# EAGLE schematic FAST_DEPLOY_E_FUSE (EAGLE 9.6.2)

## Sheet 1 of 5: LTC4222 Sheet
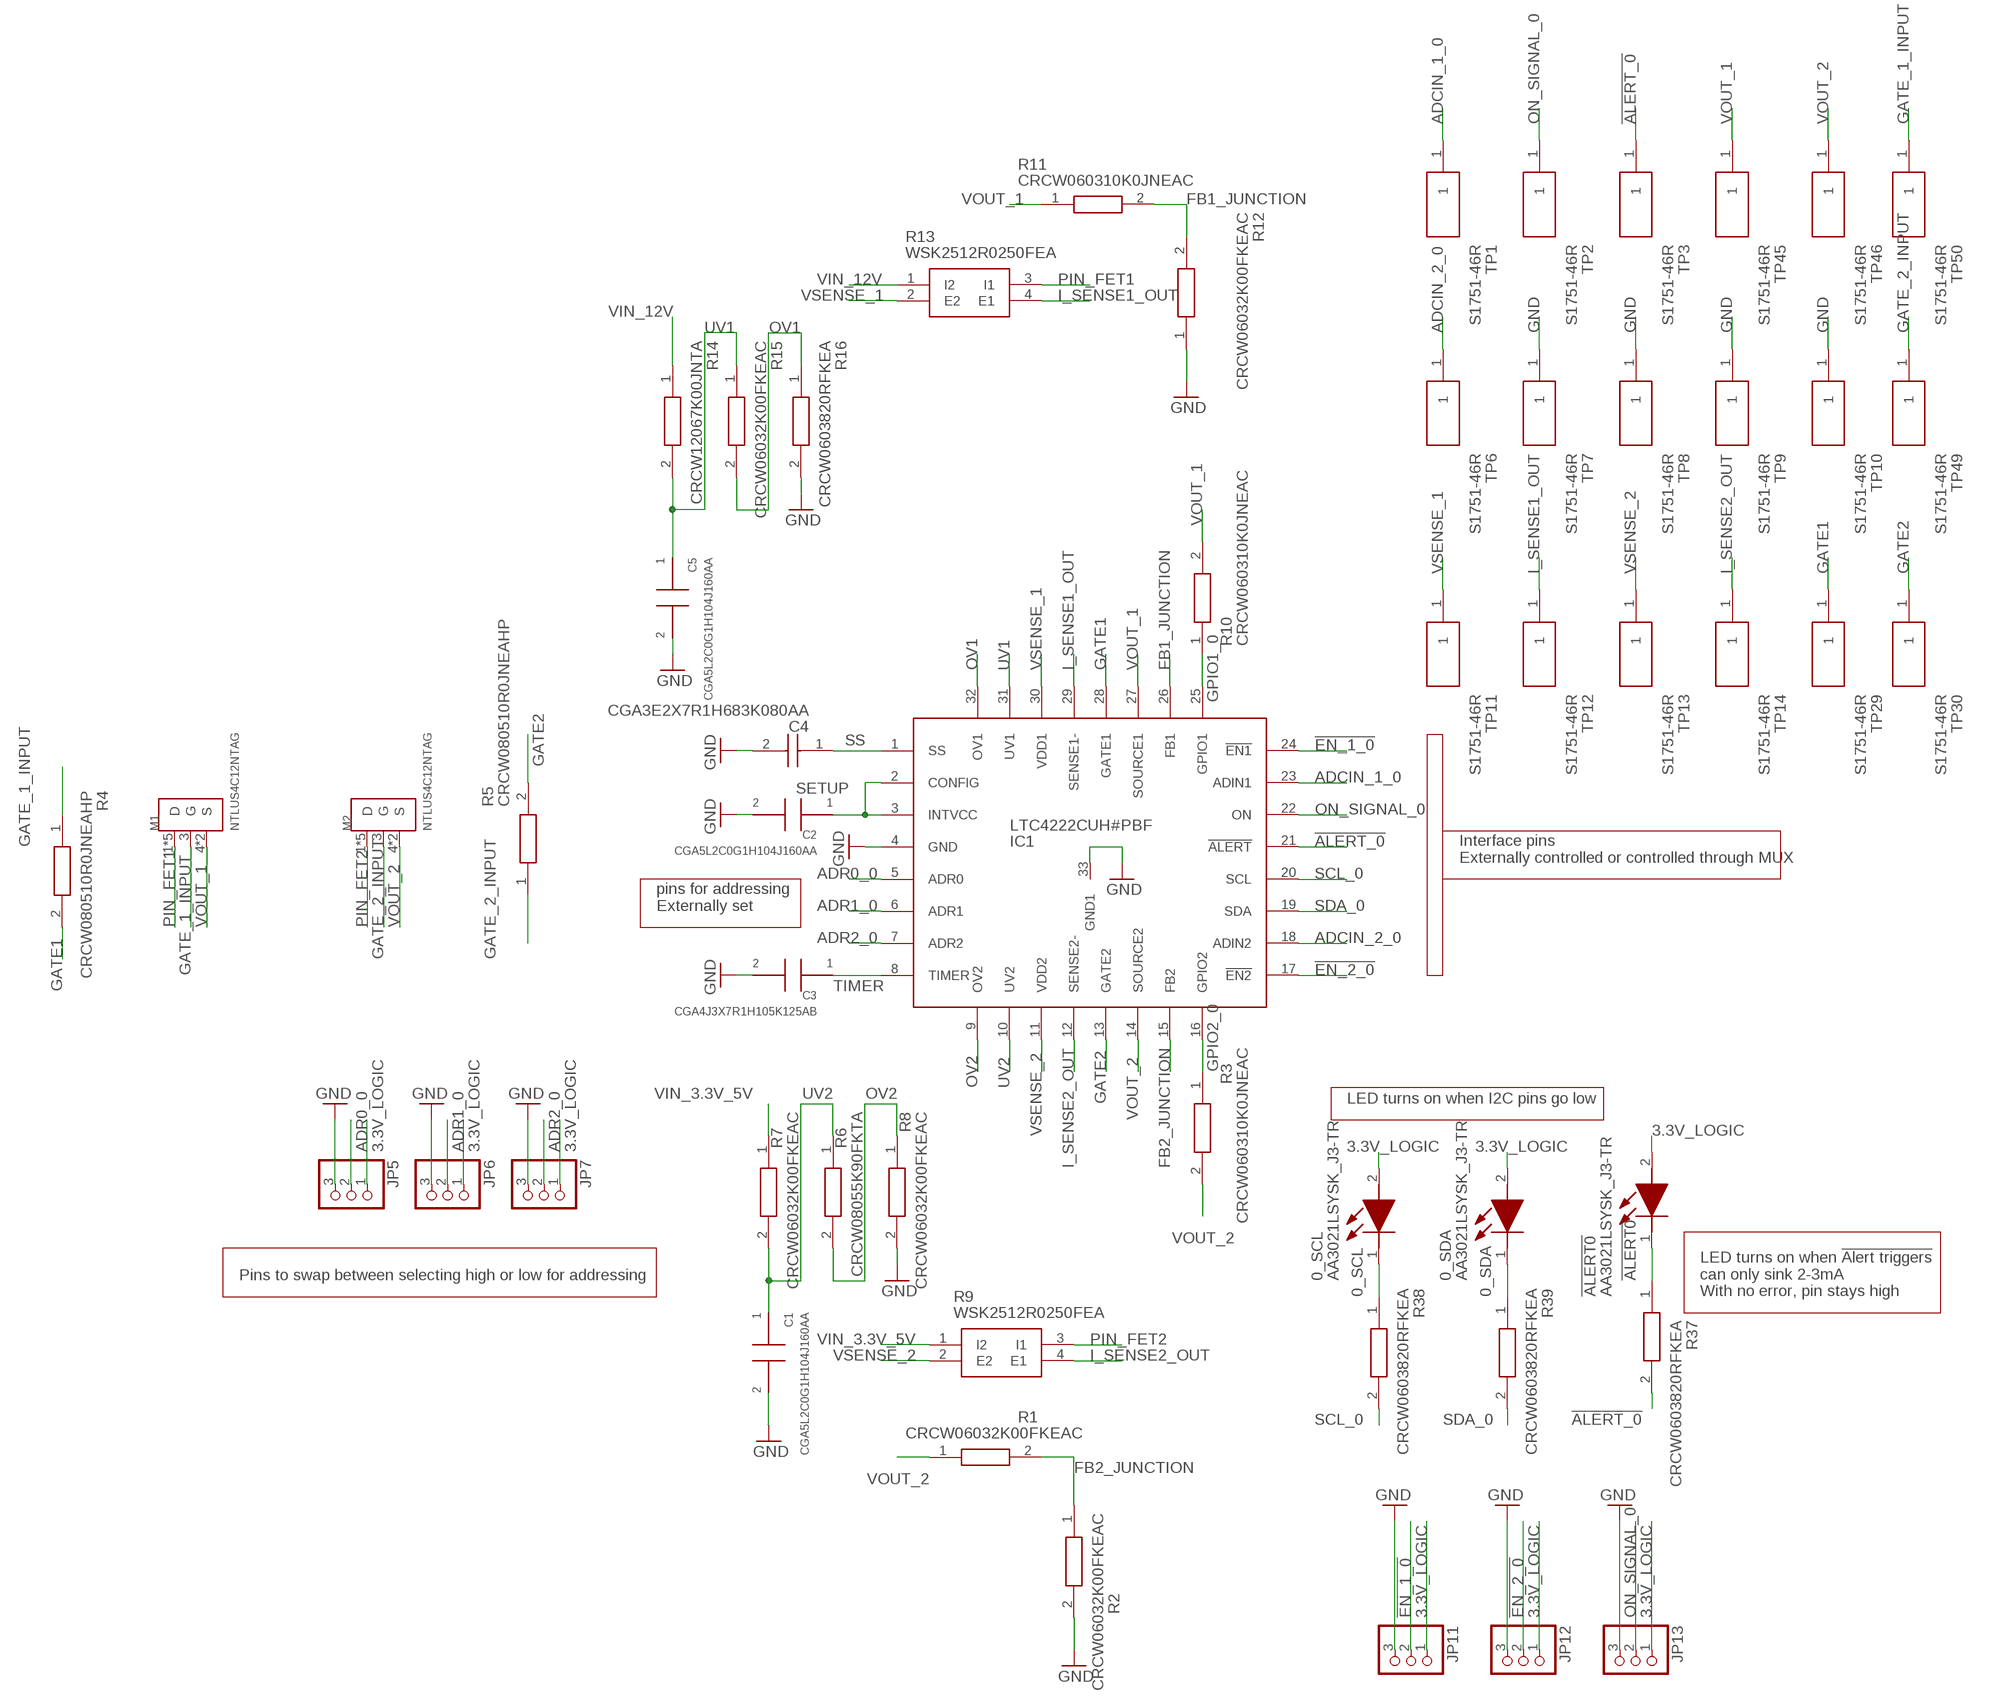
[diagram p0: schematic, sheet 1, part 1 of 2]
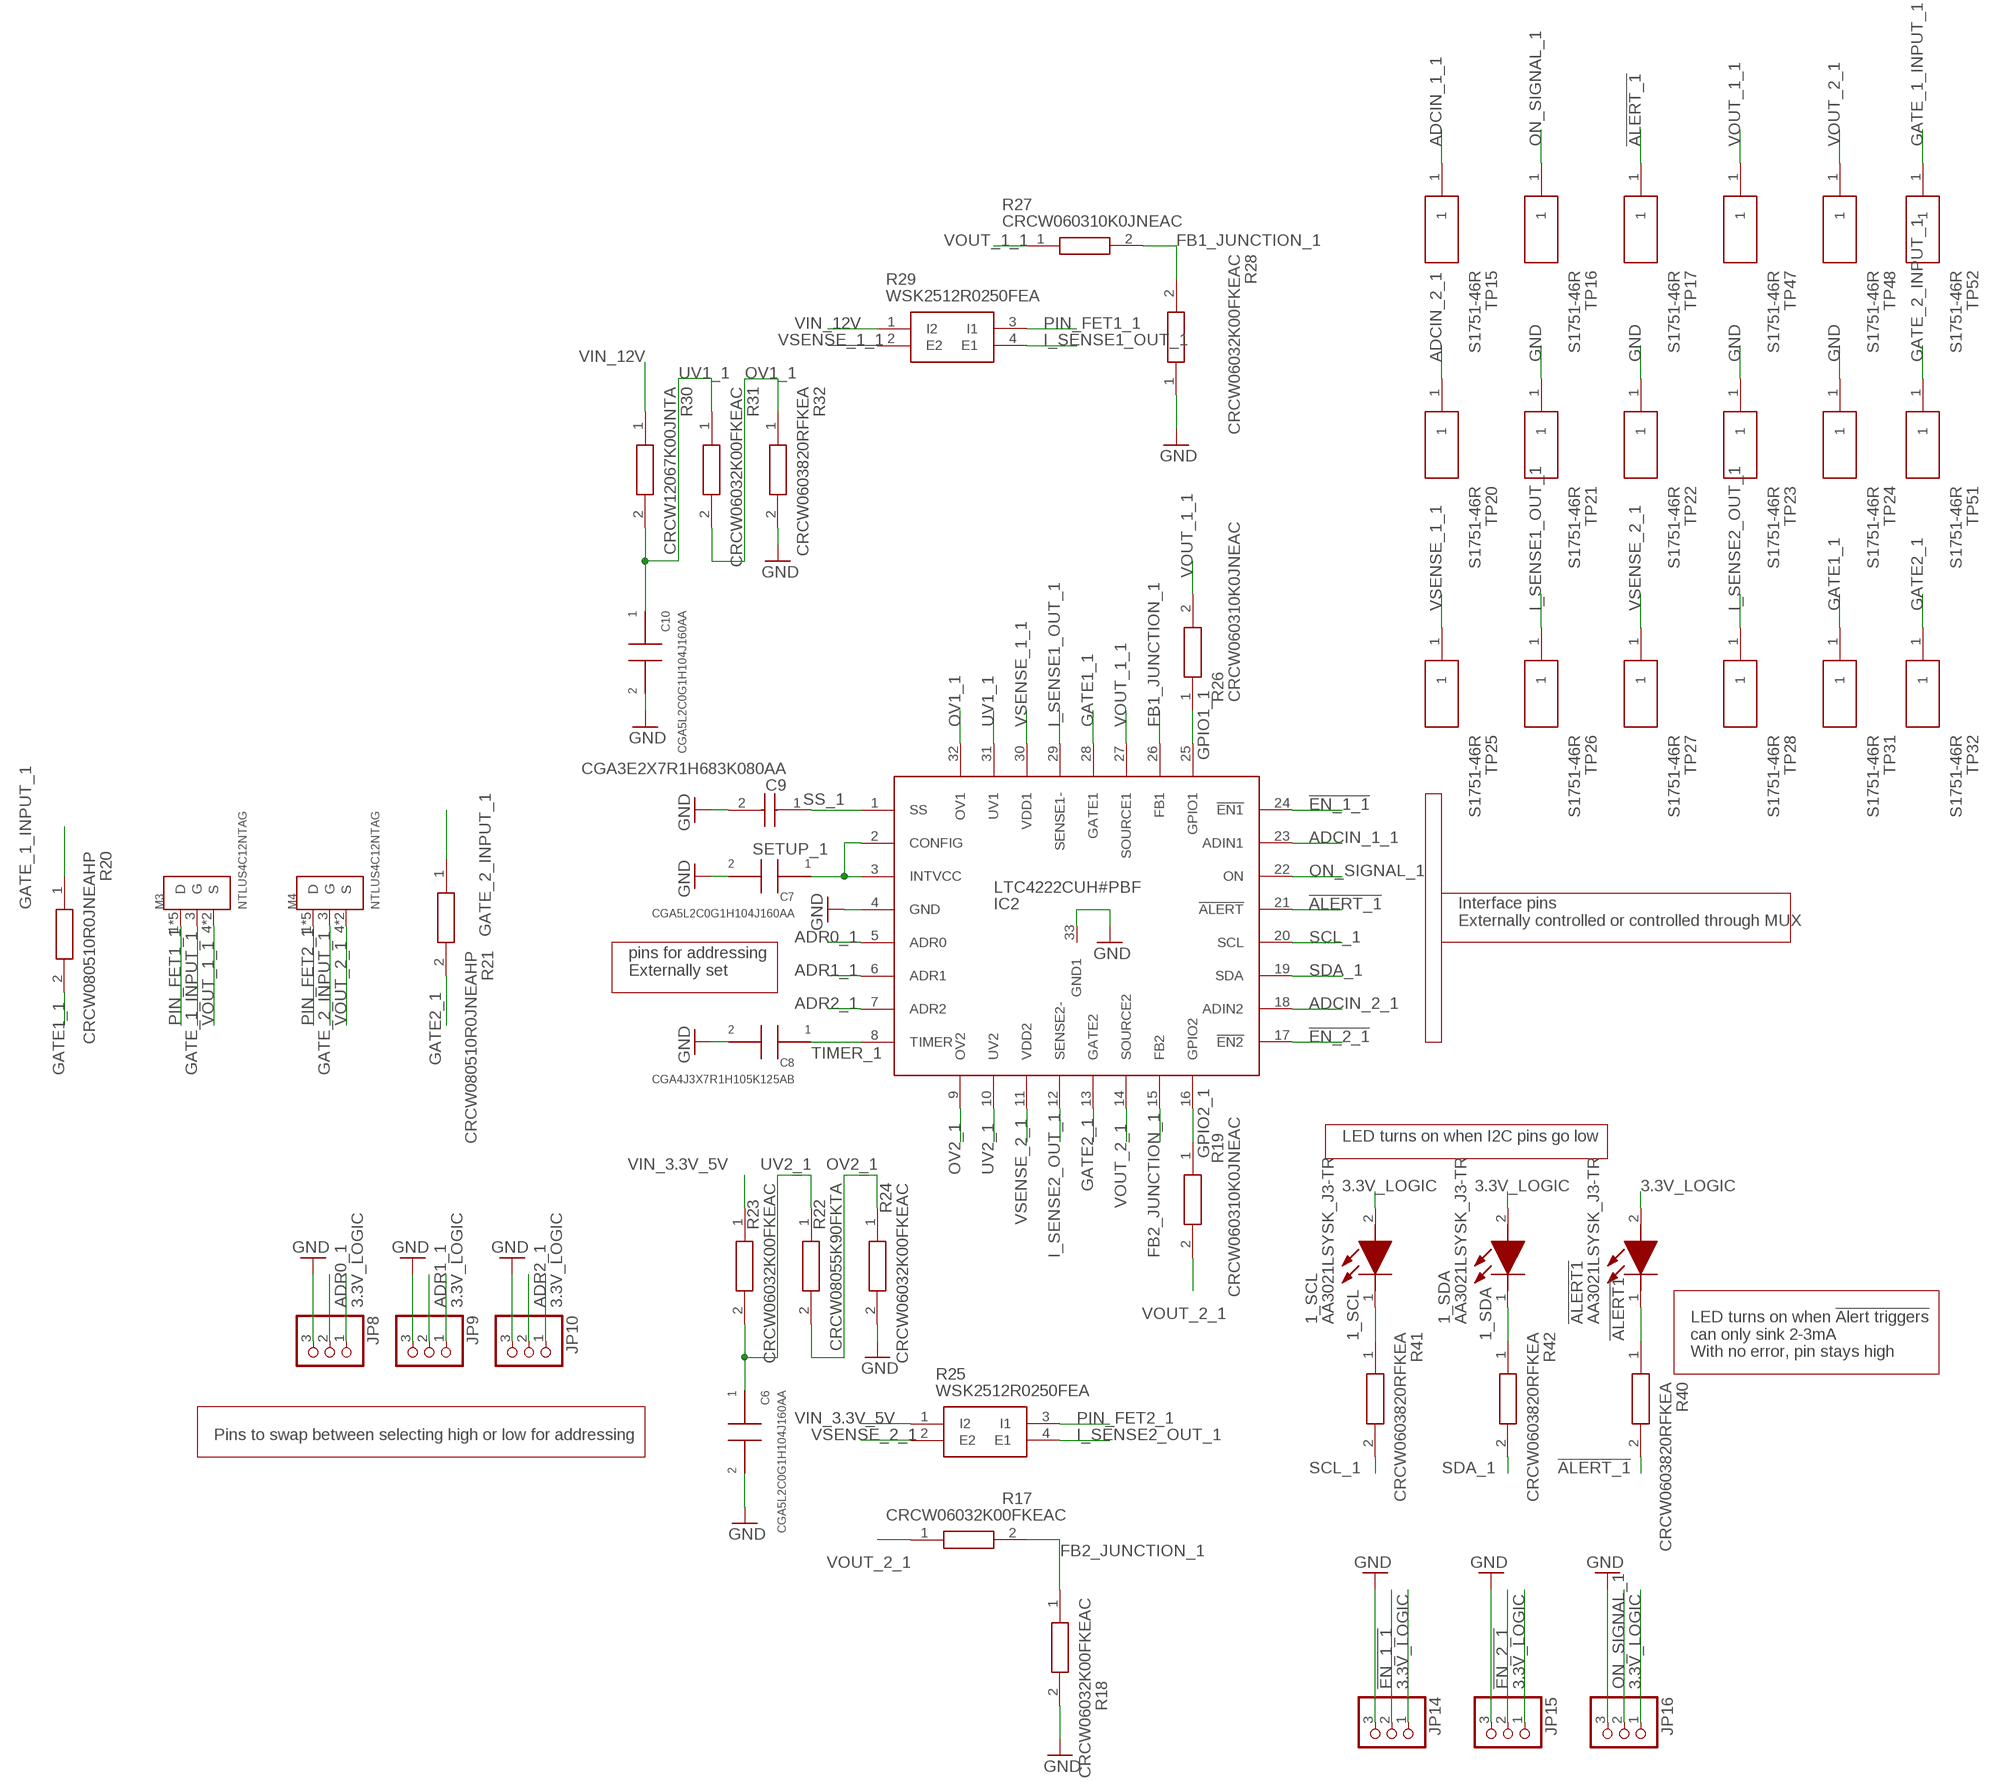
[diagram p1: schematic, sheet 1, part 2 of 2]

### Parts
0_SCL  AA3021LSYSK_J3-TR  [AA3021LSYSKJ3TR]
0_SDA  AA3021LSYSK_J3-TR  [AA3021LSYSKJ3TR]
1_SCL  AA3021LSYSK_J3-TR  [AA3021LSYSKJ3TR]
1_SDA  AA3021LSYSK_J3-TR  [AA3021LSYSKJ3TR]
!ALERT0  AA3021LSYSK_J3-TR  [AA3021LSYSKJ3TR]
!ALERT1  AA3021LSYSK_J3-TR  [AA3021LSYSKJ3TR]
C1  CGA5L2C0G1H104J160AA  [CAPC3216X180N]
C2  CGA5L2C0G1H104J160AA  [CAPC3216X180N]
C3  CGA4J3X7R1H105K125AB  [CAPC2012X145N]
C4  CGA3E2X7R1H683K080AA  [CAPC1608X90N]
C5  CGA5L2C0G1H104J160AA  [CAPC3216X180N]
C6  CGA5L2C0G1H104J160AA  [CAPC3216X180N]
C7  CGA5L2C0G1H104J160AA  [CAPC3216X180N]
C8  CGA4J3X7R1H105K125AB  [CAPC2012X145N]
C9  CGA3E2X7R1H683K080AA  [CAPC1608X90N]
C10  CGA5L2C0G1H104J160AA  [CAPC3216X180N]
IC1  LTC4222CUH#PBF  [QFN50P500X500X80-33T345N]
IC2  LTC4222CUH#PBF  [QFN50P500X500X80-33T345N]
JP5  PINHD-1X3  [1X03]
JP6  PINHD-1X3  [1X03]
JP7  PINHD-1X3  [1X03]
JP8  PINHD-1X3  [1X03]
JP9  PINHD-1X3  [1X03]
JP10  PINHD-1X3  [1X03]
JP11  PINHD-1X3  [1X03]
JP12  PINHD-1X3  [1X03]
JP13  PINHD-1X3  [1X03]
JP14  PINHD-1X3  [1X03]
JP15  PINHD-1X3  [1X03]
JP16  PINHD-1X3  [1X03]
M1  NTLUS4C12NTAG  [TRANS_NTLUS3A18PZTAG]
M2  NTLUS4C12NTAG  [TRANS_NTLUS3A18PZTAG]
M3  NTLUS4C12NTAG  [TRANS_NTLUS3A18PZTAG]
M4  NTLUS4C12NTAG  [TRANS_NTLUS3A18PZTAG]
R1  CRCW06032K00FKEAC  [RESC1608X55N]
R2  CRCW06032K00FKEAC  [RESC1608X55N]
R3  CRCW060310K0JNEAC  [RESC1608X55N]
R4  CRCW080510R0JNEAHP  [RESC2012X60N]
R5  CRCW080510R0JNEAHP  [RESC2012X60N]
R6  CRCW08055K90FKTA  [RESC2012X50N]
R7  CRCW06032K00FKEAC  [RESC1608X55N]
R8  CRCW06032K00FKEAC  [RESC1608X55N]
R9  WSK2512R0250FEA  [WSK2512R0100FEA]
R10  CRCW060310K0JNEAC  [RESC1608X55N]
R11  CRCW060310K0JNEAC  [RESC1608X55N]
R12  CRCW06032K00FKEAC  [RESC1608X55N]
R13  WSK2512R0250FEA  [WSK2512R0100FEA]
R14  CRCW12067K00JNTA  [RESC3216X60N]
R15  CRCW06032K00FKEAC  [RESC1608X55N]
R16  CRCW0603820RFKEA  [RESC1608X50N]
R17  CRCW06032K00FKEAC  [RESC1608X55N]
R18  CRCW06032K00FKEAC  [RESC1608X55N]
R19  CRCW060310K0JNEAC  [RESC1608X55N]
R20  CRCW080510R0JNEAHP  [RESC2012X60N]
R21  CRCW080510R0JNEAHP  [RESC2012X60N]
R22  CRCW08055K90FKTA  [RESC2012X50N]
R23  CRCW06032K00FKEAC  [RESC1608X55N]
R24  CRCW06032K00FKEAC  [RESC1608X55N]
R25  WSK2512R0250FEA  [WSK2512R0100FEA]
R26  CRCW060310K0JNEAC  [RESC1608X55N]
R27  CRCW060310K0JNEAC  [RESC1608X55N]
R28  CRCW06032K00FKEAC  [RESC1608X55N]
R29  WSK2512R0250FEA  [WSK2512R0100FEA]
R30  CRCW12067K00JNTA  [RESC3216X60N]
R31  CRCW06032K00FKEAC  [RESC1608X55N]
R32  CRCW0603820RFKEA  [RESC1608X50N]
R37  CRCW0603820RFKEA  [RESC1608X50N]
R38  CRCW0603820RFKEA  [RESC1608X50N]
R39  CRCW0603820RFKEA  [RESC1608X50N]
R40  CRCW0603820RFKEA  [RESC1608X50N]
R41  CRCW0603820RFKEA  [RESC1608X50N]
R42  CRCW0603820RFKEA  [RESC1608X50N]
TP1  S1751-46R  [S175146R]
TP2  S1751-46R  [S175146R]
TP3  S1751-46R  [S175146R]
TP6  S1751-46R  [S175146R]
TP7  S1751-46R  [S175146R]
TP8  S1751-46R  [S175146R]
TP9  S1751-46R  [S175146R]
TP10  S1751-46R  [S175146R]
TP11  S1751-46R  [S175146R]
TP12  S1751-46R  [S175146R]
TP13  S1751-46R  [S175146R]
TP14  S1751-46R  [S175146R]
TP15  S1751-46R  [S175146R]
TP16  S1751-46R  [S175146R]
TP17  S1751-46R  [S175146R]
TP20  S1751-46R  [S175146R]
TP21  S1751-46R  [S175146R]
TP22  S1751-46R  [S175146R]
TP23  S1751-46R  [S175146R]
TP24  S1751-46R  [S175146R]
TP25  S1751-46R  [S175146R]
TP26  S1751-46R  [S175146R]
TP27  S1751-46R  [S175146R]
TP28  S1751-46R  [S175146R]
TP29  S1751-46R  [S175146R]
TP30  S1751-46R  [S175146R]
TP31  S1751-46R  [S175146R]
TP32  S1751-46R  [S175146R]
TP45  S1751-46R  [S175146R]
TP46  S1751-46R  [S175146R]
TP47  S1751-46R  [S175146R]
TP48  S1751-46R  [S175146R]
TP49  S1751-46R  [S175146R]
TP50  S1751-46R  [S175146R]
TP51  S1751-46R  [S175146R]
TP52  S1751-46R  [S175146R]

### Nets
0_SCL: 0_SCL.1(K) R38.1
0_SDA: 0_SDA.1(K) R39.1
1_SCL: 1_SCL.1(K) R41.1
1_SDA: 1_SDA.1(K) R42.1
3.3V_LOGIC: 0_SCL.2(A) 0_SDA.2(A) 1_SCL.2(A) 1_SDA.2(A) !ALERT0.2(A) !ALERT1.2(A) JP5.1 JP6.1 JP7.1 JP8.1 JP9.1 JP10.1 JP11.1 JP12.1 JP13.1 JP14.1 JP15.1 JP16.1 ; also sheet 2,3,4,5
!ALERT0: !ALERT0.1(K) R37.1
!ALERT1: !ALERT1.1(K) R40.1
!ALERT_0: IC1.21(!ALERT) R37.2 TP3.1 ; also sheet 5
!ALERT_1: IC2.21(!ALERT) R40.2 TP17.1 ; also sheet 5
!EN_1_0: IC1.24(!EN1) JP11.2
!EN_1_1: IC2.24(!EN1) JP14.2
!EN_2_0: IC1.17(!EN2) JP12.2
!EN_2_1: IC2.17(!EN2) JP15.2
ADCIN_1_0: IC1.23(ADIN1) TP1.1 ; also sheet 5
ADCIN_1_1: IC2.23(ADIN1) TP15.1 ; also sheet 5
ADCIN_2_0: IC1.18(ADIN2) TP6.1 ; also sheet 5
ADCIN_2_1: IC2.18(ADIN2) TP20.1 ; also sheet 5
ADR0_0: IC1.5(ADR0) JP5.2
ADR0_1: IC2.5(ADR0) JP8.2
ADR1_0: IC1.6(ADR1) JP6.2
ADR1_1: IC2.6(ADR1) JP9.2
ADR2_0: IC1.7(ADR2) JP7.2
ADR2_1: IC2.7(ADR2) JP10.2
FB1_JUNCTION: IC1.26(FB1) R11.2 R12.2
FB1_JUNCTION_1: IC2.26(FB1) R27.2 R28.2
FB2_JUNCTION: IC1.15(FB2) R1.2 R2.1
FB2_JUNCTION_1: IC2.15(FB2) R17.2 R18.1
GATE1: IC1.28(GATE1) R4.2 TP29.1
GATE1_1: IC2.28(GATE1) R20.2 TP31.1
GATE2: IC1.13(GATE2) R5.2 TP30.1
GATE2_1: IC2.13(GATE2) R21.2 TP32.1
GATE_1_INPUT: M1.3(G) R4.1 TP50.1
GATE_1_INPUT_1: M3.3(G) R20.1 TP52.1
GATE_2_INPUT: M2.3(G) R5.1 TP49.1
GATE_2_INPUT_1: M4.3(G) R21.1 TP51.1
GND: C1.2 C2.2 C3.2 C4.2 C5.2 C6.2 C7.2 C8.2 C9.2 C10.2 IC1.4(GND) IC1.33(GND1) IC2.4(GND) IC2.33(GND1) JP5.3 JP6.3 JP7.3 JP8.3 JP9.3 JP10.3 JP11.3 JP12.3 JP13.3 JP14.3 JP15.3 JP16.3 R2.2 R8.2 R12.1 R16.2 R18.2 R24.2 R28.1 R32.2 TP7.1 TP8.1 TP9.1 TP10.1 TP21.1 TP22.1 TP23.1 TP24.1 ; also sheet 2,3,4,5
GPIO1_0: IC1.25(GPIO1) R10.1
GPIO1_1: IC2.25(GPIO1) R26.1
GPIO2_0: IC1.16(GPIO2) R3.1
GPIO2_1: IC2.16(GPIO2) R19.1
I_SENSE1_OUT: IC1.29(SENSE1-) R13.4(E1) TP12.1
I_SENSE1_OUT_1: IC2.29(SENSE1-) R29.4(E1) TP26.1
I_SENSE2_OUT: IC1.12(SENSE2-) R9.4(E1) TP14.1
I_SENSE2_OUT_1: IC2.12(SENSE2-) R25.4(E1) TP28.1
ON_SIGNAL_0: IC1.22(ON) JP13.2 TP2.1
ON_SIGNAL_1: IC2.22(ON) JP16.2 TP16.1
OV1: IC1.32(OV1) R15.2 R16.1
OV1_1: IC2.32(OV1) R31.2 R32.1
OV2: IC1.9(OV2) R6.2 R8.1
OV2_1: IC2.9(OV2) R22.2 R24.1
PIN_FET1: M1.1(D) M1.2(D) M1.5(D) M1.6(D) M1.7(D) R13.3(I1)
PIN_FET1_1: M3.1(D) M3.2(D) M3.5(D) M3.6(D) M3.7(D) R29.3(I1)
PIN_FET2: M2.1(D) M2.2(D) M2.5(D) M2.6(D) M2.7(D) R9.3(I1)
PIN_FET2_1: M4.1(D) M4.2(D) M4.5(D) M4.6(D) M4.7(D) R25.3(I1)
SCL_0: IC1.20(SCL) R38.2 ; also sheet 4
SCL_1: IC2.20(SCL) R41.2 ; also sheet 4
SDA_0: IC1.19(SDA) R39.2 ; also sheet 4
SDA_1: IC2.19(SDA) R42.2 ; also sheet 4
SETUP: C2.1 IC1.2(CONFIG) IC1.3(INTVCC)
SETUP_1: C7.1 IC2.2(CONFIG) IC2.3(INTVCC)
SS: C4.1 IC1.1(SS)
SS_1: C9.1 IC2.1(SS)
TIMER: C3.1 IC1.8(TIMER)
TIMER_1: C8.1 IC2.8(TIMER)
UV1: C5.1 IC1.31(UV1) R14.2 R15.1
UV1_1: C10.1 IC2.31(UV1) R30.2 R31.1
UV2: C1.1 IC1.10(UV2) R6.1 R7.2
UV2_1: C6.1 IC2.10(UV2) R22.1 R23.2
VIN_3.3V_5V: R7.1 R9.1(I2) R23.1 R25.1(I2) ; also sheet 5
VIN_12V: R13.1(I2) R14.1 R29.1(I2) R30.1 ; also sheet 5
VOUT_1: IC1.27(SOURCE1) M1.4(S) M1.8(S) R10.2 R11.1 TP45.1 ; also sheet 5
VOUT_1_1: IC2.27(SOURCE1) M3.4(S) M3.8(S) R26.2 R27.1 TP47.1 ; also sheet 5
VOUT_2: IC1.14(SOURCE2) M2.4(S) M2.8(S) R1.1 R3.2 TP46.1 ; also sheet 5
VOUT_2_1: IC2.14(SOURCE2) M4.4(S) M4.8(S) R17.1 R19.2 TP48.1 ; also sheet 5
VSENSE_1: IC1.30(VDD1) R13.2(E2) TP11.1
VSENSE_1_1: IC2.30(VDD1) R29.2(E2) TP25.1
VSENSE_2: IC1.11(VDD2) R9.2(E2) TP13.1
VSENSE_2_1: IC2.11(VDD2) R25.2(E2) TP27.1

### Notes on the sheet
- Interface pins
  Externally controlled or controlled through MUX
- Interface pins
  Externally controlled or controlled through MUX
- pins for addressing
  Externally set
- pins for addressing
  Externally set
- LED turns on when I2C pins go low
- LED turns on when I2C pins go low
- Pins to swap between selecting high or low for addressing
- LED turns on when !Alert triggers
  can only sink 2-3mA
  With no error, pin stays high
- LED turns on when !Alert triggers
  can only sink 2-3mA
  With no error, pin stays high
- Pins to swap between selecting high or low for addressing

## Sheet 2 of 5
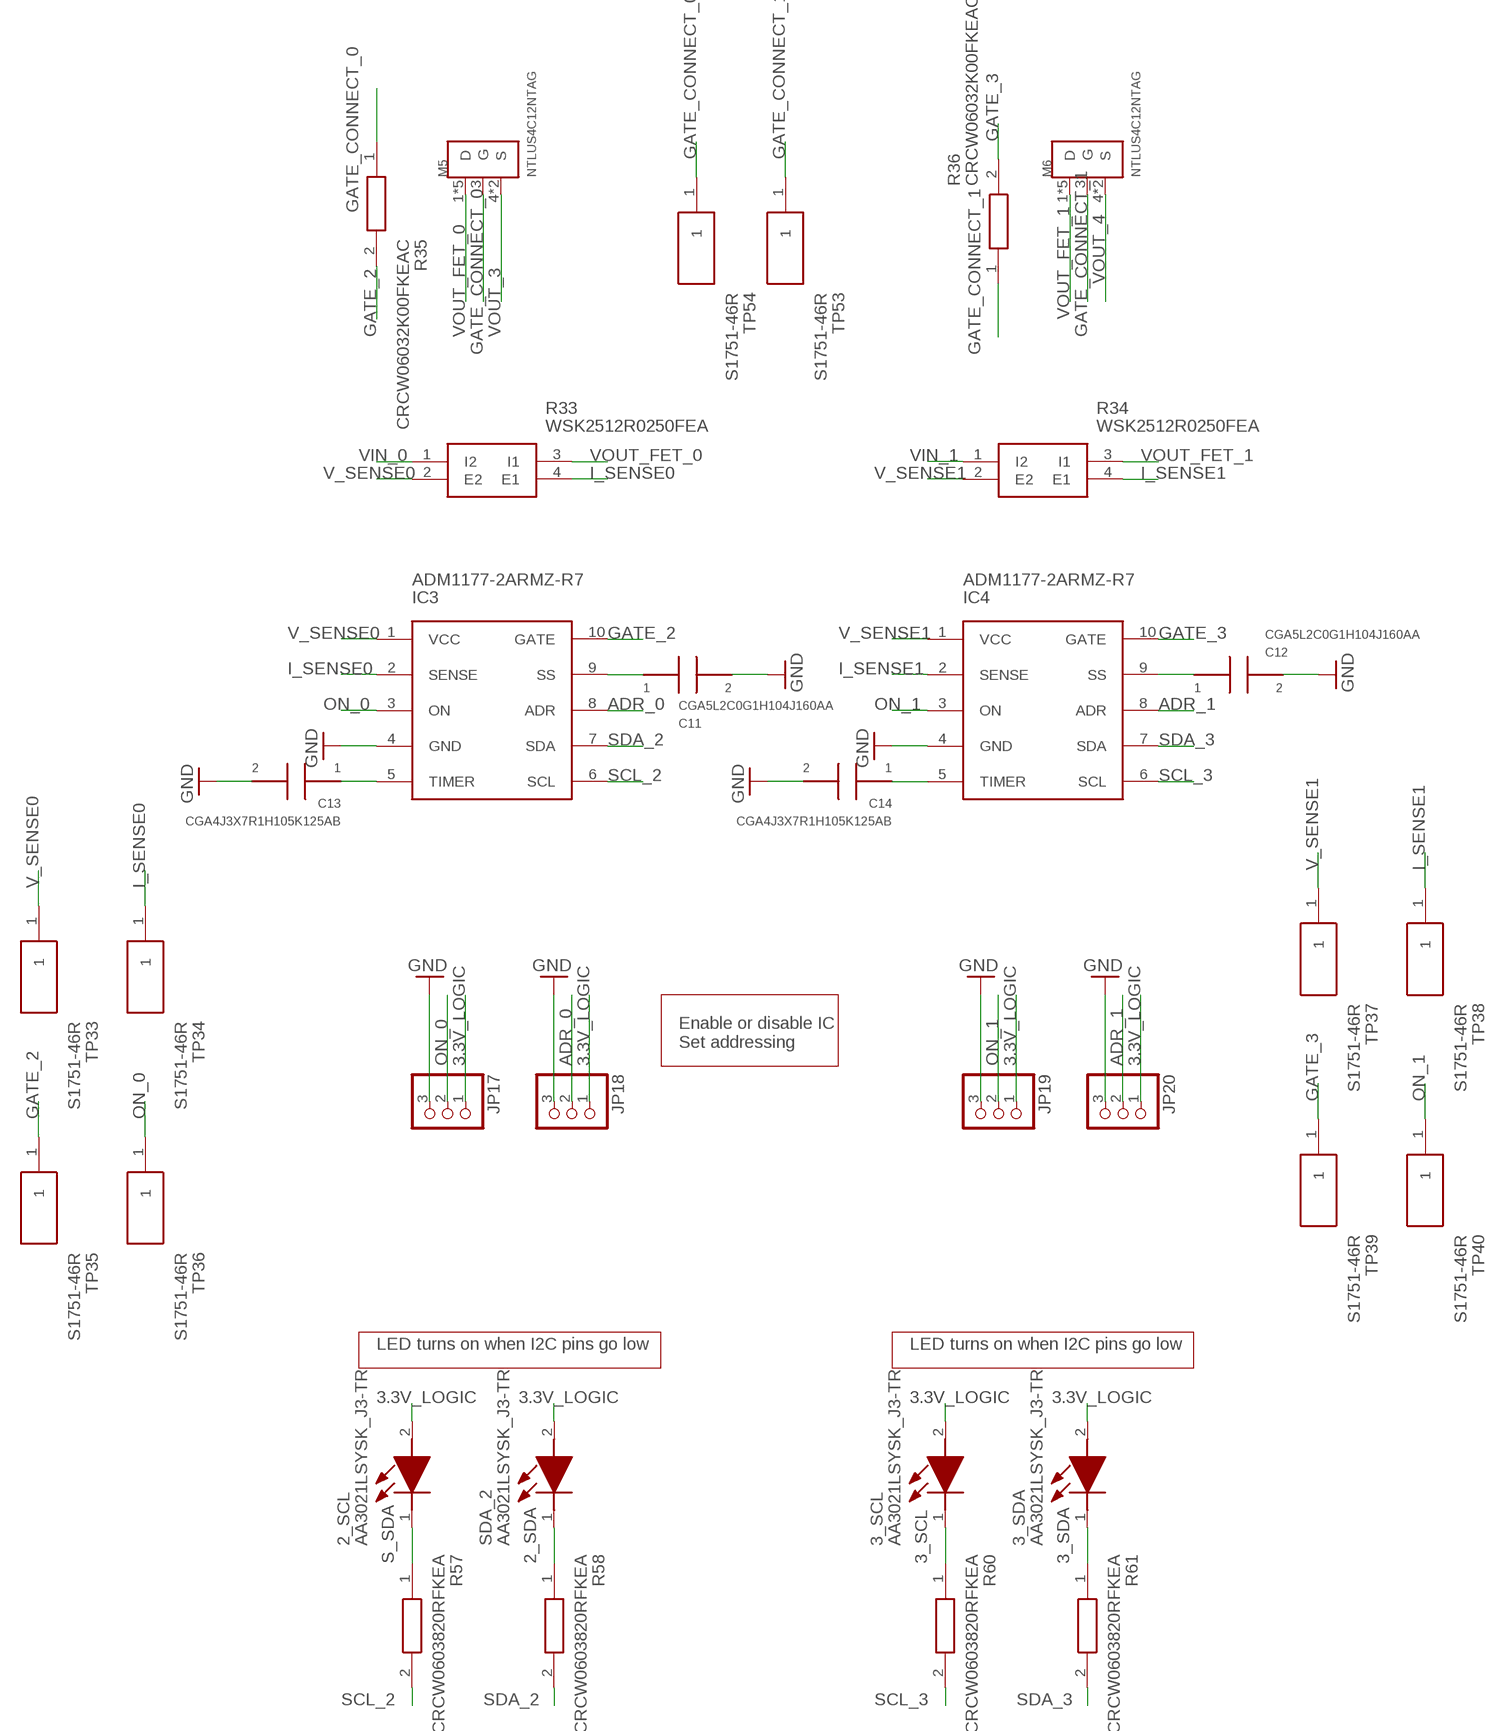
[diagram p2: schematic, sheet 2]

### Parts
2_SCL  AA3021LSYSK_J3-TR  [AA3021LSYSKJ3TR]
3_SCL  AA3021LSYSK_J3-TR  [AA3021LSYSKJ3TR]
3_SDA  AA3021LSYSK_J3-TR  [AA3021LSYSKJ3TR]
C11  CGA5L2C0G1H104J160AA  [CAPC3216X180N]
C12  CGA5L2C0G1H104J160AA  [CAPC3216X180N]
C13  CGA4J3X7R1H105K125AB  [CAPC2012X145N]
C14  CGA4J3X7R1H105K125AB  [CAPC2012X145N]
IC3  ADM1177-2ARMZ-R7  [SOP50P490X110-10N]
IC4  ADM1177-2ARMZ-R7  [SOP50P490X110-10N]
JP17  PINHD-1X3  [1X03]
JP18  PINHD-1X3  [1X03]
JP19  PINHD-1X3  [1X03]
JP20  PINHD-1X3  [1X03]
M5  NTLUS4C12NTAG  [TRANS_NTLUS3A18PZTAG]
M6  NTLUS4C12NTAG  [TRANS_NTLUS3A18PZTAG]
R33  WSK2512R0250FEA  [WSK2512R0100FEA]
R34  WSK2512R0250FEA  [WSK2512R0100FEA]
R35  CRCW06032K00FKEAC  [RESC1608X55N]
R36  CRCW06032K00FKEAC  [RESC1608X55N]
R57  CRCW0603820RFKEA  [RESC1608X50N]
R58  CRCW0603820RFKEA  [RESC1608X50N]
R60  CRCW0603820RFKEA  [RESC1608X50N]
R61  CRCW0603820RFKEA  [RESC1608X50N]
SDA_2  AA3021LSYSK_J3-TR  [AA3021LSYSKJ3TR]
TP33  S1751-46R  [S175146R]
TP34  S1751-46R  [S175146R]
TP35  S1751-46R  [S175146R]
TP36  S1751-46R  [S175146R]
TP37  S1751-46R  [S175146R]
TP38  S1751-46R  [S175146R]
TP39  S1751-46R  [S175146R]
TP40  S1751-46R  [S175146R]
TP53  S1751-46R  [S175146R]
TP54  S1751-46R  [S175146R]

### Nets
2_SDA: R58.1 SDA_2.1(K)
3.3V_LOGIC: 2_SCL.2(A) 3_SCL.2(A) 3_SDA.2(A) JP17.1 JP18.1 JP19.1 JP20.1 SDA_2.2(A) ; also sheet 1,3,4,5
3_SCL: 3_SCL.1(K) R60.1
3_SDA: 3_SDA.1(K) R61.1
ADR_0: IC3.8(ADR) JP18.2
ADR_1: IC4.8(ADR) JP20.2
GATE_2: IC3.10(GATE) R35.2 TP35.1
GATE_3: IC4.10(GATE) R36.2 TP39.1
GATE_CONNECT_0: M5.3(G) R35.1 TP54.1
GATE_CONNECT_1: M6.3(G) R36.1 TP53.1
GND: C11.2 C12.2 C13.2 C14.2 IC3.4(GND) IC4.4(GND) JP17.3 JP18.3 JP19.3 JP20.3 ; also sheet 1,3,4,5
I_SENSE0: IC3.2(SENSE) R33.4(E1) TP34.1
I_SENSE1: IC4.2(SENSE) R34.4(E1) TP38.1
N$9: C11.1 IC3.9(SS)
N$10: C13.1 IC3.5(TIMER)
N$11: C14.1 IC4.5(TIMER)
N$12: C12.1 IC4.9(SS)
ON_0: IC3.3(ON) JP17.2 TP36.1
ON_1: IC4.3(ON) JP19.2 TP40.1
S_SDA: 2_SCL.1(K) R57.1
SCL_2: IC3.6(SCL) R57.2 ; also sheet 4
SCL_3: IC4.6(SCL) R60.2 ; also sheet 4
SDA_2: IC3.7(SDA) R58.2 ; also sheet 4
SDA_3: IC4.7(SDA) R61.2 ; also sheet 4
V_SENSE0: IC3.1(VCC) R33.2(E2) TP33.1
V_SENSE1: IC4.1(VCC) R34.2(E2) TP37.1
VIN_0: R33.1(I2) ; also sheet 5
VIN_1: R34.1(I2) ; also sheet 5
VOUT_3: M5.4(S) M5.8(S) ; also sheet 5
VOUT_4: M6.4(S) M6.8(S) ; also sheet 5
VOUT_FET_0: M5.1(D) M5.2(D) M5.5(D) M5.6(D) M5.7(D) R33.3(I1)
VOUT_FET_1: M6.1(D) M6.2(D) M6.5(D) M6.6(D) M6.7(D) R34.3(I1)

### Notes on the sheet
- Enable or disable IC
  Set addressing
- LED turns on when I2C pins go low | LED turns on when I2C pins go low

## Sheet 3 of 5
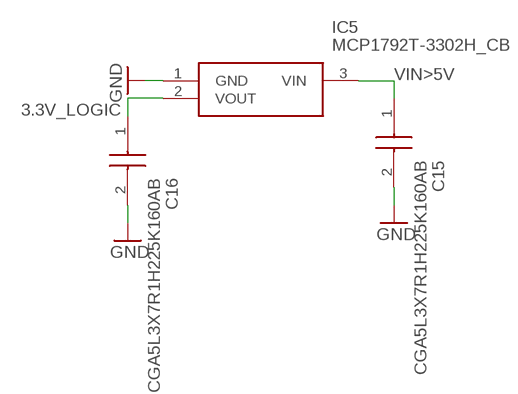
[diagram p3: schematic, sheet 3]

### Parts
C15  CGA5L3X7R1H225K160AB  [CAPC3216X190N]
C16  CGA5L3X7R1H225K160AB  [CAPC3216X190N]
IC5  MCP1792T-3302H_CB  [SOT95P255X145-3N]

### Nets
3.3V_LOGIC: C16.1 IC5.2(VOUT) ; also sheet 1,2,4,5
GND: C15.2 C16.2 IC5.1(GND) ; also sheet 1,2,4,5
VIN>5V: C15.1 IC5.3(VIN) ; also sheet 5

## Sheet 4 of 5
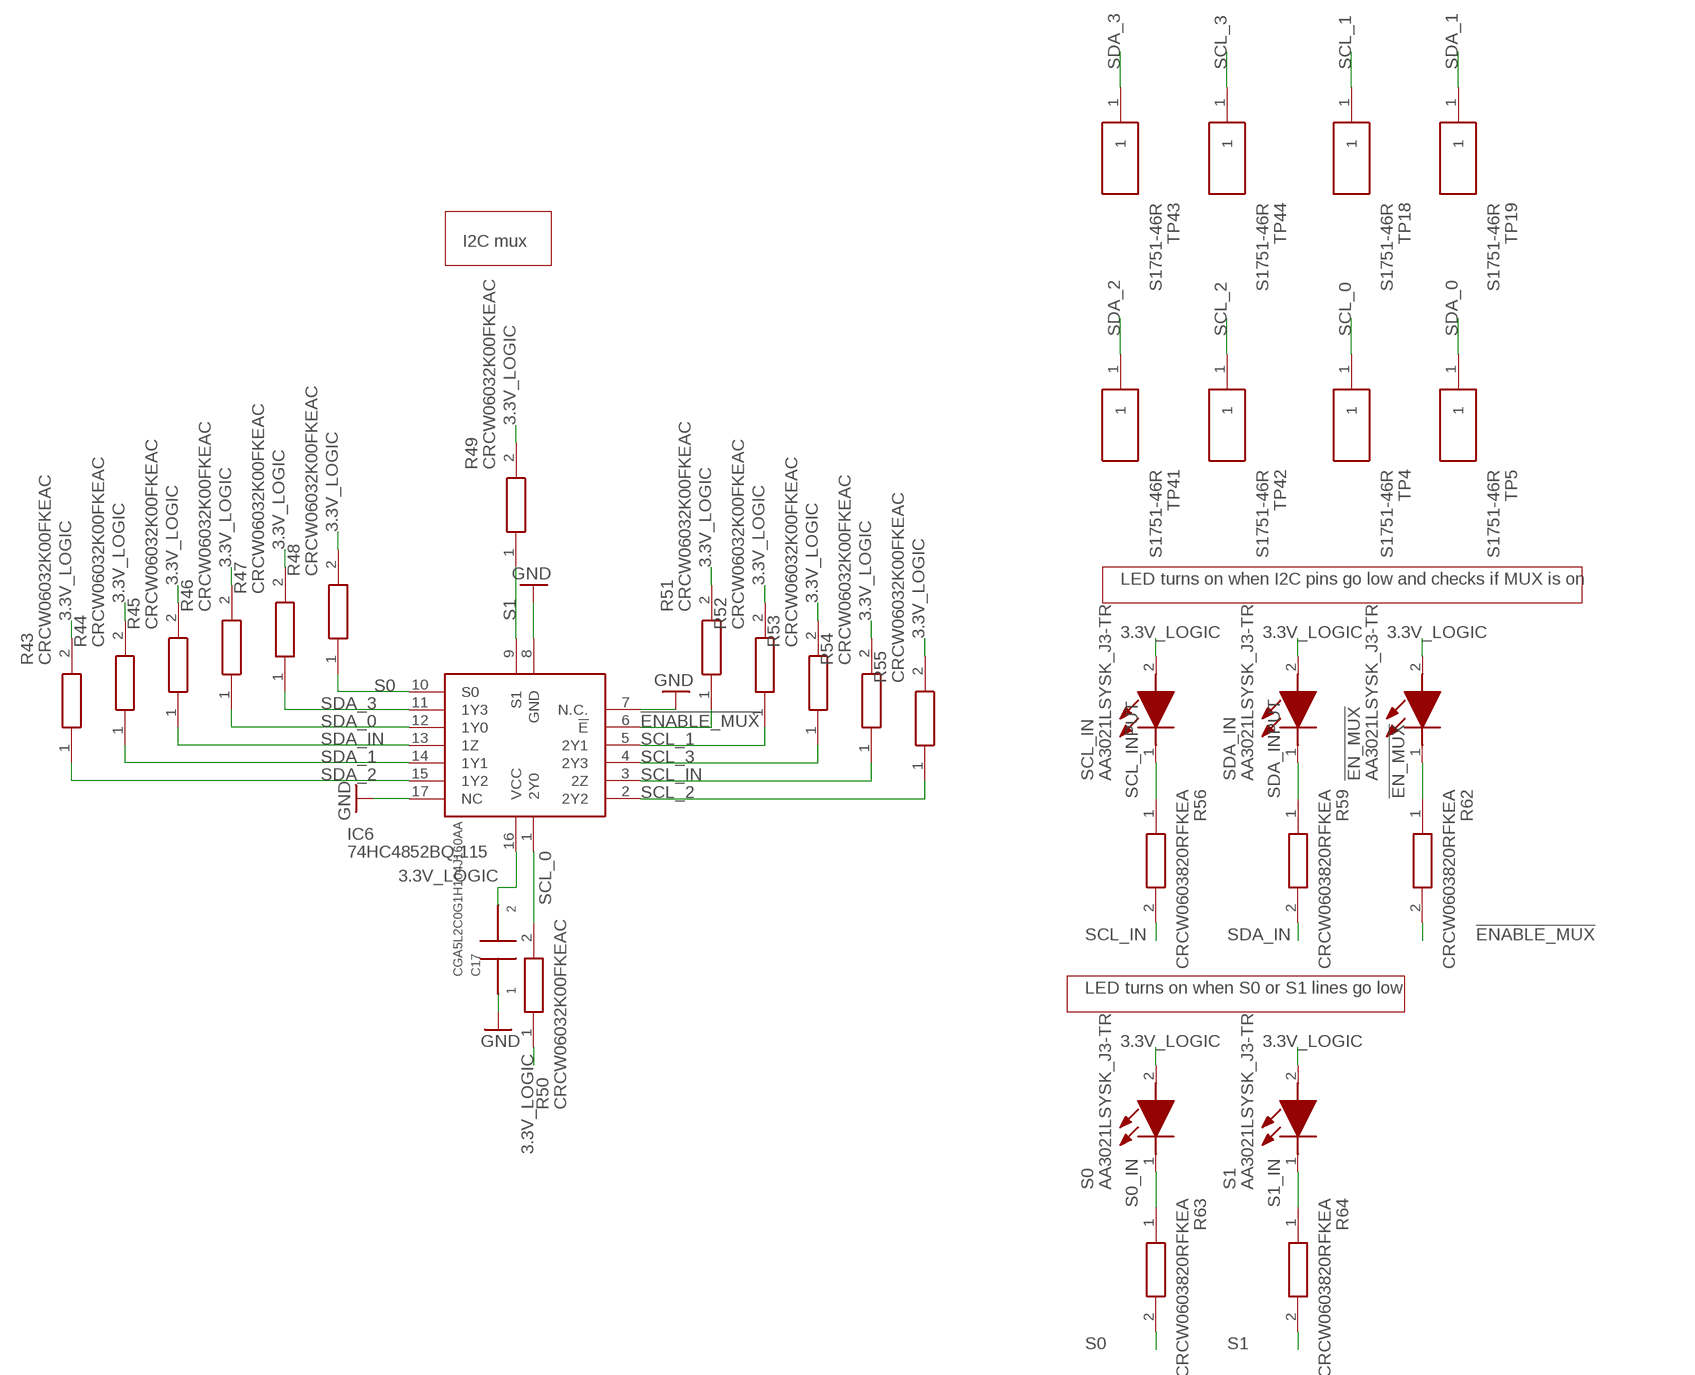
[diagram p4: schematic, sheet 4]

### Parts
!EN_MUX  AA3021LSYSK_J3-TR  [AA3021LSYSKJ3TR]
C17  CGA5L2C0G1H104J160AA  [CAPC3216X180N]
IC6  74HC4852BQ,115  [74HCT595BQ115]
R43  CRCW06032K00FKEAC  [RESC1608X55N]
R44  CRCW06032K00FKEAC  [RESC1608X55N]
R45  CRCW06032K00FKEAC  [RESC1608X55N]
R46  CRCW06032K00FKEAC  [RESC1608X55N]
R47  CRCW06032K00FKEAC  [RESC1608X55N]
R48  CRCW06032K00FKEAC  [RESC1608X55N]
R49  CRCW06032K00FKEAC  [RESC1608X55N]
R50  CRCW06032K00FKEAC  [RESC1608X55N]
R51  CRCW06032K00FKEAC  [RESC1608X55N]
R52  CRCW06032K00FKEAC  [RESC1608X55N]
R53  CRCW06032K00FKEAC  [RESC1608X55N]
R54  CRCW06032K00FKEAC  [RESC1608X55N]
R55  CRCW06032K00FKEAC  [RESC1608X55N]
R56  CRCW0603820RFKEA  [RESC1608X50N]
R59  CRCW0603820RFKEA  [RESC1608X50N]
R62  CRCW0603820RFKEA  [RESC1608X50N]
R63  CRCW0603820RFKEA  [RESC1608X50N]
R64  CRCW0603820RFKEA  [RESC1608X50N]
S0  AA3021LSYSK_J3-TR  [AA3021LSYSKJ3TR]
S1  AA3021LSYSK_J3-TR  [AA3021LSYSKJ3TR]
SCL_IN  AA3021LSYSK_J3-TR  [AA3021LSYSKJ3TR]
SDA_IN  AA3021LSYSK_J3-TR  [AA3021LSYSKJ3TR]
TP4  S1751-46R  [S175146R]
TP5  S1751-46R  [S175146R]
TP18  S1751-46R  [S175146R]
TP19  S1751-46R  [S175146R]
TP41  S1751-46R  [S175146R]
TP42  S1751-46R  [S175146R]
TP43  S1751-46R  [S175146R]
TP44  S1751-46R  [S175146R]

### Nets
3.3V_LOGIC: !EN_MUX.2(A) C17.2 IC6.16(VCC) R43.2 R44.2 R45.2 R46.2 R47.2 R48.2 R49.2 R50.1 R51.2 R52.2 R53.2 R54.2 R55.2 S0.2(A) S1.2(A) SCL_IN.2(A) SDA_IN.2(A) ; also sheet 1,2,3,5
!EN_MUX: !EN_MUX.1(K) R62.1
!ENABLE_MUX: IC6.6(!E) R51.1 R62.2 ; also sheet 5
GND: C17.1 IC6.7(N.C.) IC6.8(GND) IC6.17(NC) ; also sheet 1,2,3,5
S0: IC6.10(S0) R48.1 R63.2 ; also sheet 5
S0_IN: R63.1 S0.1(K)
S1: IC6.9(S1) R49.1 R64.2 ; also sheet 5
S1_IN: R64.1 S1.1(K)
SCL_0: IC6.1(2Y0) R50.2 TP4.1 ; also sheet 1
SCL_1: IC6.5(2Y1) R52.1 TP18.1 ; also sheet 1
SCL_2: IC6.2(2Y2) R55.1 TP42.1 ; also sheet 2
SCL_3: IC6.4(2Y3) R53.1 TP44.1 ; also sheet 2
SCL_IN: IC6.3(2Z) R54.1 R56.2 ; also sheet 5
SCL_INPUT: R56.1 SCL_IN.1(K)
SDA_0: IC6.12(1Y0) R46.1 TP5.1 ; also sheet 1
SDA_1: IC6.14(1Y1) R44.1 TP19.1 ; also sheet 1
SDA_2: IC6.15(1Y2) R43.1 TP41.1 ; also sheet 2
SDA_3: IC6.11(1Y3) R47.1 TP43.1 ; also sheet 2
SDA_IN: IC6.13(1Z) R45.1 R59.2 ; also sheet 5
SDA_INPUT: R59.1 SDA_IN.1(K)

### Notes on the sheet
- I2C mux
- LED turns on when I2C pins go low and checks if MUX is on
- LED turns on when S0 or S1 lines go low

## Sheet 5 of 5
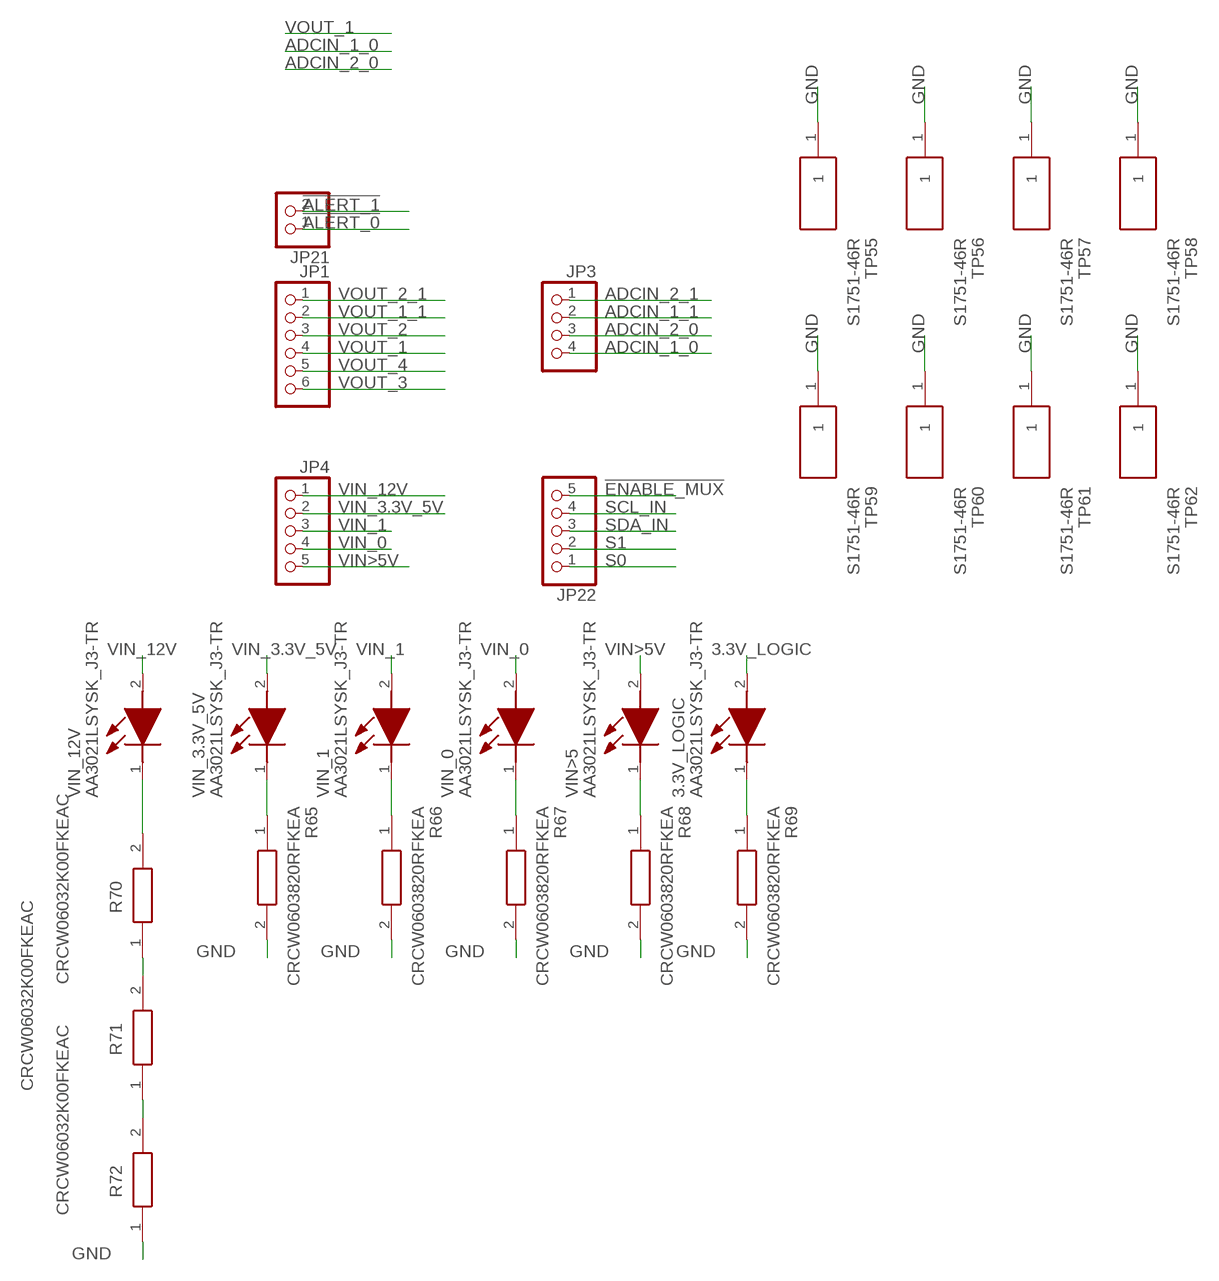
[diagram p5: schematic, sheet 5]

### Parts
3.3V_LOGIC  AA3021LSYSK_J3-TR  [AA3021LSYSKJ3TR]
JP1  PINHD-1X6  [1X06]
JP3  PINHD-1X4  [1X04]
JP4  PINHD-1X5  [1X05]
JP21  PINHD-1X2  [1X02]
JP22  PINHD-1X5  [1X05]
R65  CRCW0603820RFKEA  [RESC1608X50N]
R66  CRCW0603820RFKEA  [RESC1608X50N]
R67  CRCW0603820RFKEA  [RESC1608X50N]
R68  CRCW0603820RFKEA  [RESC1608X50N]
R69  CRCW0603820RFKEA  [RESC1608X50N]
R70  CRCW06032K00FKEAC  [RESC1608X55N]
R71  CRCW06032K00FKEAC  [RESC1608X55N]
R72  CRCW06032K00FKEAC  [RESC1608X55N]
TP55  S1751-46R  [S175146R]
TP56  S1751-46R  [S175146R]
TP57  S1751-46R  [S175146R]
TP58  S1751-46R  [S175146R]
TP59  S1751-46R  [S175146R]
TP60  S1751-46R  [S175146R]
TP61  S1751-46R  [S175146R]
TP62  S1751-46R  [S175146R]
VIN>5  AA3021LSYSK_J3-TR  [AA3021LSYSKJ3TR]
VIN_0  AA3021LSYSK_J3-TR  [AA3021LSYSKJ3TR]
VIN_1  AA3021LSYSK_J3-TR  [AA3021LSYSKJ3TR]
VIN_3.3V_5V  AA3021LSYSK_J3-TR  [AA3021LSYSKJ3TR]
VIN_12V  AA3021LSYSK_J3-TR  [AA3021LSYSKJ3TR]

### Nets
3.3V_LOGIC: 3.3V_LOGIC.2(A) ; also sheet 1,2,3,4
!ALERT_0: JP21.1 ; also sheet 1
!ALERT_1: JP21.2 ; also sheet 1
!ENABLE_MUX: JP22.5 ; also sheet 4
ADCIN_1_0: JP3.4 ; also sheet 1
ADCIN_1_1: JP3.2 ; also sheet 1
ADCIN_2_0: JP3.3 ; also sheet 1
ADCIN_2_1: JP3.1 ; also sheet 1
GND: R65.2 R66.2 R67.2 R68.2 R69.2 R72.1 TP55.1 TP56.1 TP57.1 TP58.1 TP59.1 TP60.1 TP61.1 TP62.1 ; also sheet 1,2,3,4
N$1: R70.1 R71.2
N$2: R71.1 R72.2
N$3: R70.2 VIN_12V.1(K)
N$4: R65.1 VIN_3.3V_5V.1(K)
N$5: R66.1 VIN_1.1(K)
N$6: R67.1 VIN_0.1(K)
N$7: R68.1 VIN>5.1(K)
N$8: 3.3V_LOGIC.1(K) R69.1
S0: JP22.1 ; also sheet 4
S1: JP22.2 ; also sheet 4
SCL_IN: JP22.4 ; also sheet 4
SDA_IN: JP22.3 ; also sheet 4
VIN>5V: JP4.5 VIN>5.2(A) ; also sheet 3
VIN_0: JP4.4 VIN_0.2(A) ; also sheet 2
VIN_1: JP4.3 VIN_1.2(A) ; also sheet 2
VIN_3.3V_5V: JP4.2 VIN_3.3V_5V.2(A) ; also sheet 1
VIN_12V: JP4.1 VIN_12V.2(A) ; also sheet 1
VOUT_1: JP1.4 ; also sheet 1
VOUT_1_1: JP1.2 ; also sheet 1
VOUT_2: JP1.3 ; also sheet 1
VOUT_2_1: JP1.1 ; also sheet 1
VOUT_3: JP1.6 ; also sheet 2
VOUT_4: JP1.5 ; also sheet 2

## Library data of the parts
0_SCL 0_SDA 1_SCL 1_SDA 2_SCL 3.3V_LOGIC 3_SCL 3_SDA !ALERT0 !ALERT1 !EN_MUX S0 S1 SCL_IN SDA_2 SDA_IN VIN>5 VIN_0 VIN_1 VIN_3.3V_5V VIN_12V = SamacSys_Parts:AA3021LSYSK_J3-TR: Standard LEDs - SMD 3mmX2mm SMD LED LAMP SB YELLOW Source: Datasheet <https://eagle.componentsearchengine.com/Datasheets/1/AA3021LSYSK_J3-TR.pdf>; DESCRIPTION: Standard LEDs - SMD 3mmX2mm SMD LED LAMP SB YELLOW; HEIGHT: 1.3mm; MANUFACTURER_NAME: Kingbright; MANUFACTURER_PART_NUMBER: AA3021LSYSK/J3-TR; MOUSER_PART_NUMBER: 604-AA3021LSYSK/J3TR; MOUSER_PRICE-STOCK: https://www.mouser.co.uk/ProductDetail/Kingbright/AA3021LSYSK-J3-TR?qs=Oo40KB9lBTmS1V8p5PSO3Q%3D%3D
C1 C2 C5-C7 C10-C12 C17 = SamacSys_Parts:CGA5L2C0G1H104J160AA: Multilayer Ceramic Capacitors MLCC - SMD/SMT CGA 1206 50V 0.1uF C0G 5% AEC-Q200 Source: Datasheet <https://product.tdk.com/system/files/dam/doc/product/capacitor/ceramic/mlcc/catalog/mlcc_automotive_general_en.pdf?ref_disty=mouser>; DESCRIPTION: CGA5L2C0G1H104J160AA; HEIGHT: 1.6; MANUFACTURER_NAME: TDK; MANUFACTURER_PART_NUMBER: CGA5L2C0G1H104J160AA; MOUSER_PART_NUMBER: 810-CGA5L2C0G1H104J; MOUSER_PRICE_STOCK: https://www.mouser.com/ProductDetail/TDK/CGA5L2C0G1H104J160AA?qs=FxQuwy19cyB%252BudXVGaf5CA%3D%3D
C3 C8 C13 C14 = SamacSys_Parts:CGA4J3X7R1H105K125AB: Multilayer Ceramic Capacitors MLCC - SMD/SMT CGA 0805 50V 1uF X7R 10% AEC-Q200 Source: Datasheet <https://product.tdk.com/system/files/dam/doc/product/capacitor/ceramic/mlcc/catalog/mlcc_automotive_general_en.pdf?ref_disty=mouser>; DESCRIPTION: Multilayer Ceramic Capacitors MLCC - SMD/SMT CGA 0805 50V 1uF X7R 10% AEC-Q200; HEIGHT: 1.25mm; MANUFACTURER_NAME: TDK; MANUFACTURER_PART_NUMBER: CGA4J3X7R1H105K125AB; MOUSER_PART_NUMBER: 810-CGA4J3X7R1H105K; MOUSER_STOCK_PRICE: https://www.mouser.com/ProductDetail/TDK/CGA4J3X7R1H105K125AB?qs=NRhsANhppD9cK8XQyI1JTg%3D%3D
C4 C9 = SamacSys_Parts:CGA3E2X7R1H683K080AA: TDK - CGA3E2X7R1H683K080AA - CAP, MLCC, X7R, 0.068UF, 50V, 0603 Source: Datasheet <https://datasheet.datasheetarchive.com/originals/distributors/Datasheets-DGA20/25667.pdf>; DESCRIPTION: TDK - CGA3E2X7R1H683K080AA - CAP, MLCC, X7R, 0.068UF, 50V, 0603; HEIGHT: 0.9mm; MANUFACTURER_NAME: TDK; MANUFACTURER_PART_NUMBER: CGA3E2X7R1H683K080AA
C15 C16 = SamacSys_Parts:CGA5L3X7R1H225K160AB: MLCC CGA 1206 X7R 2.2uF 50V Automotive TDK 3216 CGA 2.2uF Ceramic Multilayer Capacitor, 50 V dc, +125C, X7R Dielectric, +/-10% Source: Datasheet <https://componentsearchengine.com/Datasheets/1/CGA5L3X7R1H225K160AB.pdf>; DESCRIPTION: MLCC CGA 1206 X7R 2.2uF 50V Automotive TDK 3216 CGA 2.2uF Ceramic Multilayer Capacitor, 50 V dc, +125C, X7R Dielectric, +/-10%; HEIGHT: 1.9mm; MANUFACTURER_NAME: TDK; MANUFACTURER_PART_NUMBER: CGA5L3X7R1H225K160AB; MOUSER_PART_NUMBER: 810-CGA5L3X7R1H225K; MOUSER_PRICE-STOCK: https://www.mouser.com/Search/Refine.aspx?Keyword=810-CGA5L3X7R1H225K
IC1 IC2 = SamacSys_Parts:LTC4222CUH#PBF: Hot Swap Voltage Controllers Dual Hot Swap Controller w/ADC and I2C Source: Datasheet <https://www.mouser.com/datasheet/2/609/4222fb-1270163.pdf>; DESCRIPTION: Hot Swap Voltage Controllers Dual Hot Swap Controller w/ADC and I2C; HEIGHT: 0.75; MANUFACTURER_NAME: Analog Devices; MANUFACTURER_PART_NUMBER: LTC4222CUH#PBF; MOUSER_PART_NUMBER: 584-LTC4222CUH#PBF; MOUSER_PRICE-STOCK: https://www.mouser.com/ProductDetail/Analog-Devices/LTC4222CUHPBF?qs=hVkxg5c3xu9PWFTJ4vRWUw%3D%3D
IC3 IC4 = SamacSys_Parts:ADM1177-2ARMZ-R7: Hot Swap Voltage Controllers ON Pin + Latched Off I.C. Source: Datasheet <https://www.mouser.com/datasheet/2/609/ADM1177-1503109.pdf>; DESCRIPTION: Hot Swap Voltage Controllers ON Pin + Latched Off I.C.; HEIGHT: 1.1mm; MANUFACTURER_NAME: Analog Devices; MANUFACTURER_PART_NUMBER: ADM1177-2ARMZ-R7; MOUSER_PART_NUMBER: 584-ADM1177-2ARMZ-R7; MOUSER_PRICE-STOCK: https://www.mouser.com/ProductDetail/Analog-Devices/ADM1177-2ARMZ-R7?qs=sGAEpiMZZMsjJi7B1kCaqUwb7%252BssKgH%2FhAltG8zytI8%3D
IC5 = SamacSys_Parts:MCP1792T-3302H_CB: LDO Voltage Regulators High input voltage regulator 3.3V 3Ld SOT-23A TR Source: Datasheet; DESCRIPTION: LDO Voltage Regulators High input voltage regulator 3.3V 3Ld SOT-23A TR; HEIGHT: 1.45mm; MANUFACTURER_NAME: Microchip; MANUFACTURER_PART_NUMBER: MCP1792T-3302H/CB; MOUSER_PART_NUMBER: 579-MCP1792T-3302HCB; MOUSER_PRICE-STOCK: https://www.mouser.co.uk/ProductDetail/Microchip-Technology/MCP1792T-3302H-CB?qs=mAH9sUMRCtsJR7ybQ6HmQA%3D%3D
IC6 = SamacSys_Parts:74HC4852BQ,115: 74HC(T)4852 - Dual 4-channel analog multiplexer/demultiplexer with injection-current effect control@en-us Source: Datasheet <https://componentsearchengine.com/Datasheets/1/74HC4852BQ,115.pdf>; DESCRIPTION: 74HC(T)4852 - Dual 4-channel analog multiplexer/demultiplexer with injection-current effect control@en-us; HEIGHT: mm; MANUFACTURER_NAME: Nexperia; MANUFACTURER_PART_NUMBER: 74HC4852BQ,115; MOUSER_PART_NUMBER: 771-HC4852BQ115; MOUSER_PRICE-STOCK: https://www.mouser.com/Search/Refine.aspx?Keyword=771-HC4852BQ115
JP1 = pinhead:PINHD-1X6: PIN HEADER
JP3 = pinhead:PINHD-1X4: PIN HEADER
JP4 JP22 = pinhead:PINHD-1X5: PIN HEADER
JP5-JP20 = pinhead:PINHD-1X3: PIN HEADER
JP21 = pinhead:PINHD-1X2: PIN HEADER
M1-M6 = SamacSys_Parts:NTLUS4C12NTAG
R1 R2 R7 R8 R12 R15 R17 R18 R23 R24 R28 R31 R35 R36 R43-R55 R70-R72 = SamacSys_Parts:CRCW06032K00FKEAC: D11/CRCW0603-C 100 2K0 1% ET1 Source: Datasheet <http://www.vishay.com/docs/28773/crcwce3.pdf>; DESCRIPTION: D11/CRCW0603-C 100 2K0 1% ET1; HEIGHT: 0.55mm; MANUFACTURER_NAME: Vishay; MANUFACTURER_PART_NUMBER: CRCW06032K00FKEAC; MOUSER_PART_NUMBER: 71-CRCW06032K00FKEAC; MOUSER_PRICE-STOCK: https://www.mouser.co.uk/ProductDetail/Vishay-Dale/CRCW06032K00FKEAC?qs=E3Y5ESvWgWOwN4nEBlBdhQ%3D%3D
R3 R10 R11 R19 R26 R27 = SamacSys_Parts:CRCW060310K0JNEAC: Thick Film Resistors - SMD 1/10Watt 10Kohms 5% Commercial Use Source: Datasheet <https://rs.componentsearchengine.com/Datasheets/1/CRCW060310K0JNEAC.pdf>; DESCRIPTION: Thick Film Resistors - SMD 1/10Watt 10Kohms 5% Commercial Use; HEIGHT: 0.55mm; MANUFACTURER_NAME: Vishay; MANUFACTURER_PART_NUMBER: CRCW060310K0JNEAC; MOUSER_PART_NUMBER: 71-CRCW060310K0JNEAC; MOUSER_PRICE-STOCK: https://www.mouser.co.uk/ProductDetail/Vishay-Dale/CRCW060310K0JNEAC?qs=E3Y5ESvWgWPA6tgMSHKX3A%3D%3D
R4 R5 R20 R21 = SamacSys_Parts:CRCW080510R0JNEAHP: Thick Film Resistors - SMD 1/2watt 10ohms 5% High Power AEC-Q200 Source: Datasheet <https://componentsearchengine.com/Datasheets/1/CRCW08051R00FKEAHP.pdf>; DESCRIPTION: Thick Film Resistors - SMD 1/2watt 10ohms 5% High Power AEC-Q200; HEIGHT: 0.6mm; MANUFACTURER_NAME: Vishay; MANUFACTURER_PART_NUMBER: CRCW080510R0JNEAHP; MOUSER_PART_NUMBER: 71-CRCW080510R0JNEAH; MOUSER_PRICE-STOCK: https://www.mouser.co.uk/ProductDetail/Vishay-Dale/CRCW080510R0JNEAHP?qs=k2%2FDWSARqgECF6a1IBPDeg%3D%3D
R6 R22 = SamacSys_Parts:CRCW08055K90FKTA: Thick Film Resistors - SMD 1/8watt 5.9Kohms 1% 100ppm Source: Datasheet <https://componentsearchengine.com/Datasheets/1/CRCW08055K90FKTA.pdf>; DESCRIPTION: Thick Film Resistors - SMD 1/8watt 5.9Kohms 1% 100ppm; HEIGHT: 0.5mm; MANUFACTURER_NAME: Vishay; MANUFACTURER_PART_NUMBER: CRCW08055K90FKTA; MOUSER_PART_NUMBER: 71-CRCW0805-5.9K; MOUSER_PRICE-STOCK: https://www.mouser.com/Search/Refine.aspx?Keyword=71-CRCW0805-5.9K
R9 R13 R25 R29 R33 R34 = SamacSys_Parts:WSK2512R0250FEA: Current Sense Resistors - SMD 1watt .025ohm 1% Source: Datasheet <https://www.vishay.com/docs/30108/wsk2512.pdf>; DESCRIPTION: Current Sense Resistors - SMD 1watt .025ohm 1%; HEIGHT: 0mm; MANUFACTURER_NAME: Vishay; MANUFACTURER_PART_NUMBER: WSK2512R0250FEA; MOUSER_PART_NUMBER: 71-WSK2512R0250FEA; MOUSER_PRICE-STOCK: https://www.mouser.co.uk/ProductDetail/Vishay-Dale/WSK2512R0250FEA?qs=l%252BoLuM8chxrVGAQkLso4sw%3D%3D
R14 R30 = SamacSys_Parts:CRCW12067K00JNTA: Thick Film Resistors - SMD 1/4watt 7Kohms 5% Non-Standard number Source: Datasheet <https://componentsearchengine.com/Datasheets/1/CRCW12067K00JNTA.pdf>; DESCRIPTION: Thick Film Resistors - SMD 1/4watt 7Kohms 5% Non-Standard number; HEIGHT: 0.6mm; MANUFACTURER_NAME: Vishay; MANUFACTURER_PART_NUMBER: CRCW12067K00JNTA; MOUSER_PART_NUMBER: 71-CRCW1206702JT; MOUSER_PRICE-STOCK: https://www.mouser.com/Search/Refine.aspx?Keyword=71-CRCW1206702JT
R16 R32 R37-R42 R56-R69 = SamacSys_Parts:CRCW0603820RFKEA: Vishay CRCW Series Thick Film Surface Mount Resistor 0603 Case 820 +/-1% 0.1W +/-100ppm/C Source: Datasheet <http://www.vishay.com/docs/20035/dcrcwe3.pdf>; DESCRIPTION: Vishay CRCW Series Thick Film Surface Mount Resistor 0603 Case 820 +/-1% 0.1W +/-100ppm/C; HEIGHT: 0.5mm; MANUFACTURER_NAME: Vishay; MANUFACTURER_PART_NUMBER: CRCW0603820RFKEA; MOUSER_PART_NUMBER: 71-CRCW0603-820-E3; MOUSER_PRICE-STOCK: https://www.mouser.co.uk/ProductDetail/Vishay-Dale/CRCW0603820RFKEA?qs=HyTSJ3hXp3J4RIWfWuiOyA%3D%3D
TP1-TP62 = SamacSys_Parts:S1751-46R: EZ_Boardware SMT Test Point 2.0mm high S1751-46R, Brass Grounding Contact Used with Surface Mount, 3.25 x 2 x 1.65 Source: Datasheet <https://cdn.harwin.com/pdfs/S1751R.pdf>; DESCRIPTION: EZ_Boardware SMT Test Point 2.0mm high S1751-46R, Brass Grounding Contact Used with Surface Mount, 3.25 x 2 x 1.65; HEIGHT: 2mm; MANUFACTURER_NAME: Harwin; MANUFACTURER_PART_NUMBER: S1751-46R; MOUSER_PART_NUMBER: 855-S1751-46R; MOUSER_PRICE-STOCK: https://www.mouser.co.uk/ProductDetail/Harwin/S1751-46R?qs=l6ZPVqNVZb71wETAKrfRig%3D%3D